# Altium schematic sheet Upstream.SchDoc: USB-C Upstream Port
size 431 x 279 mm; Author: Eric Liu; Revision: 1; SheetNumber: 2; SheetTotal: 2
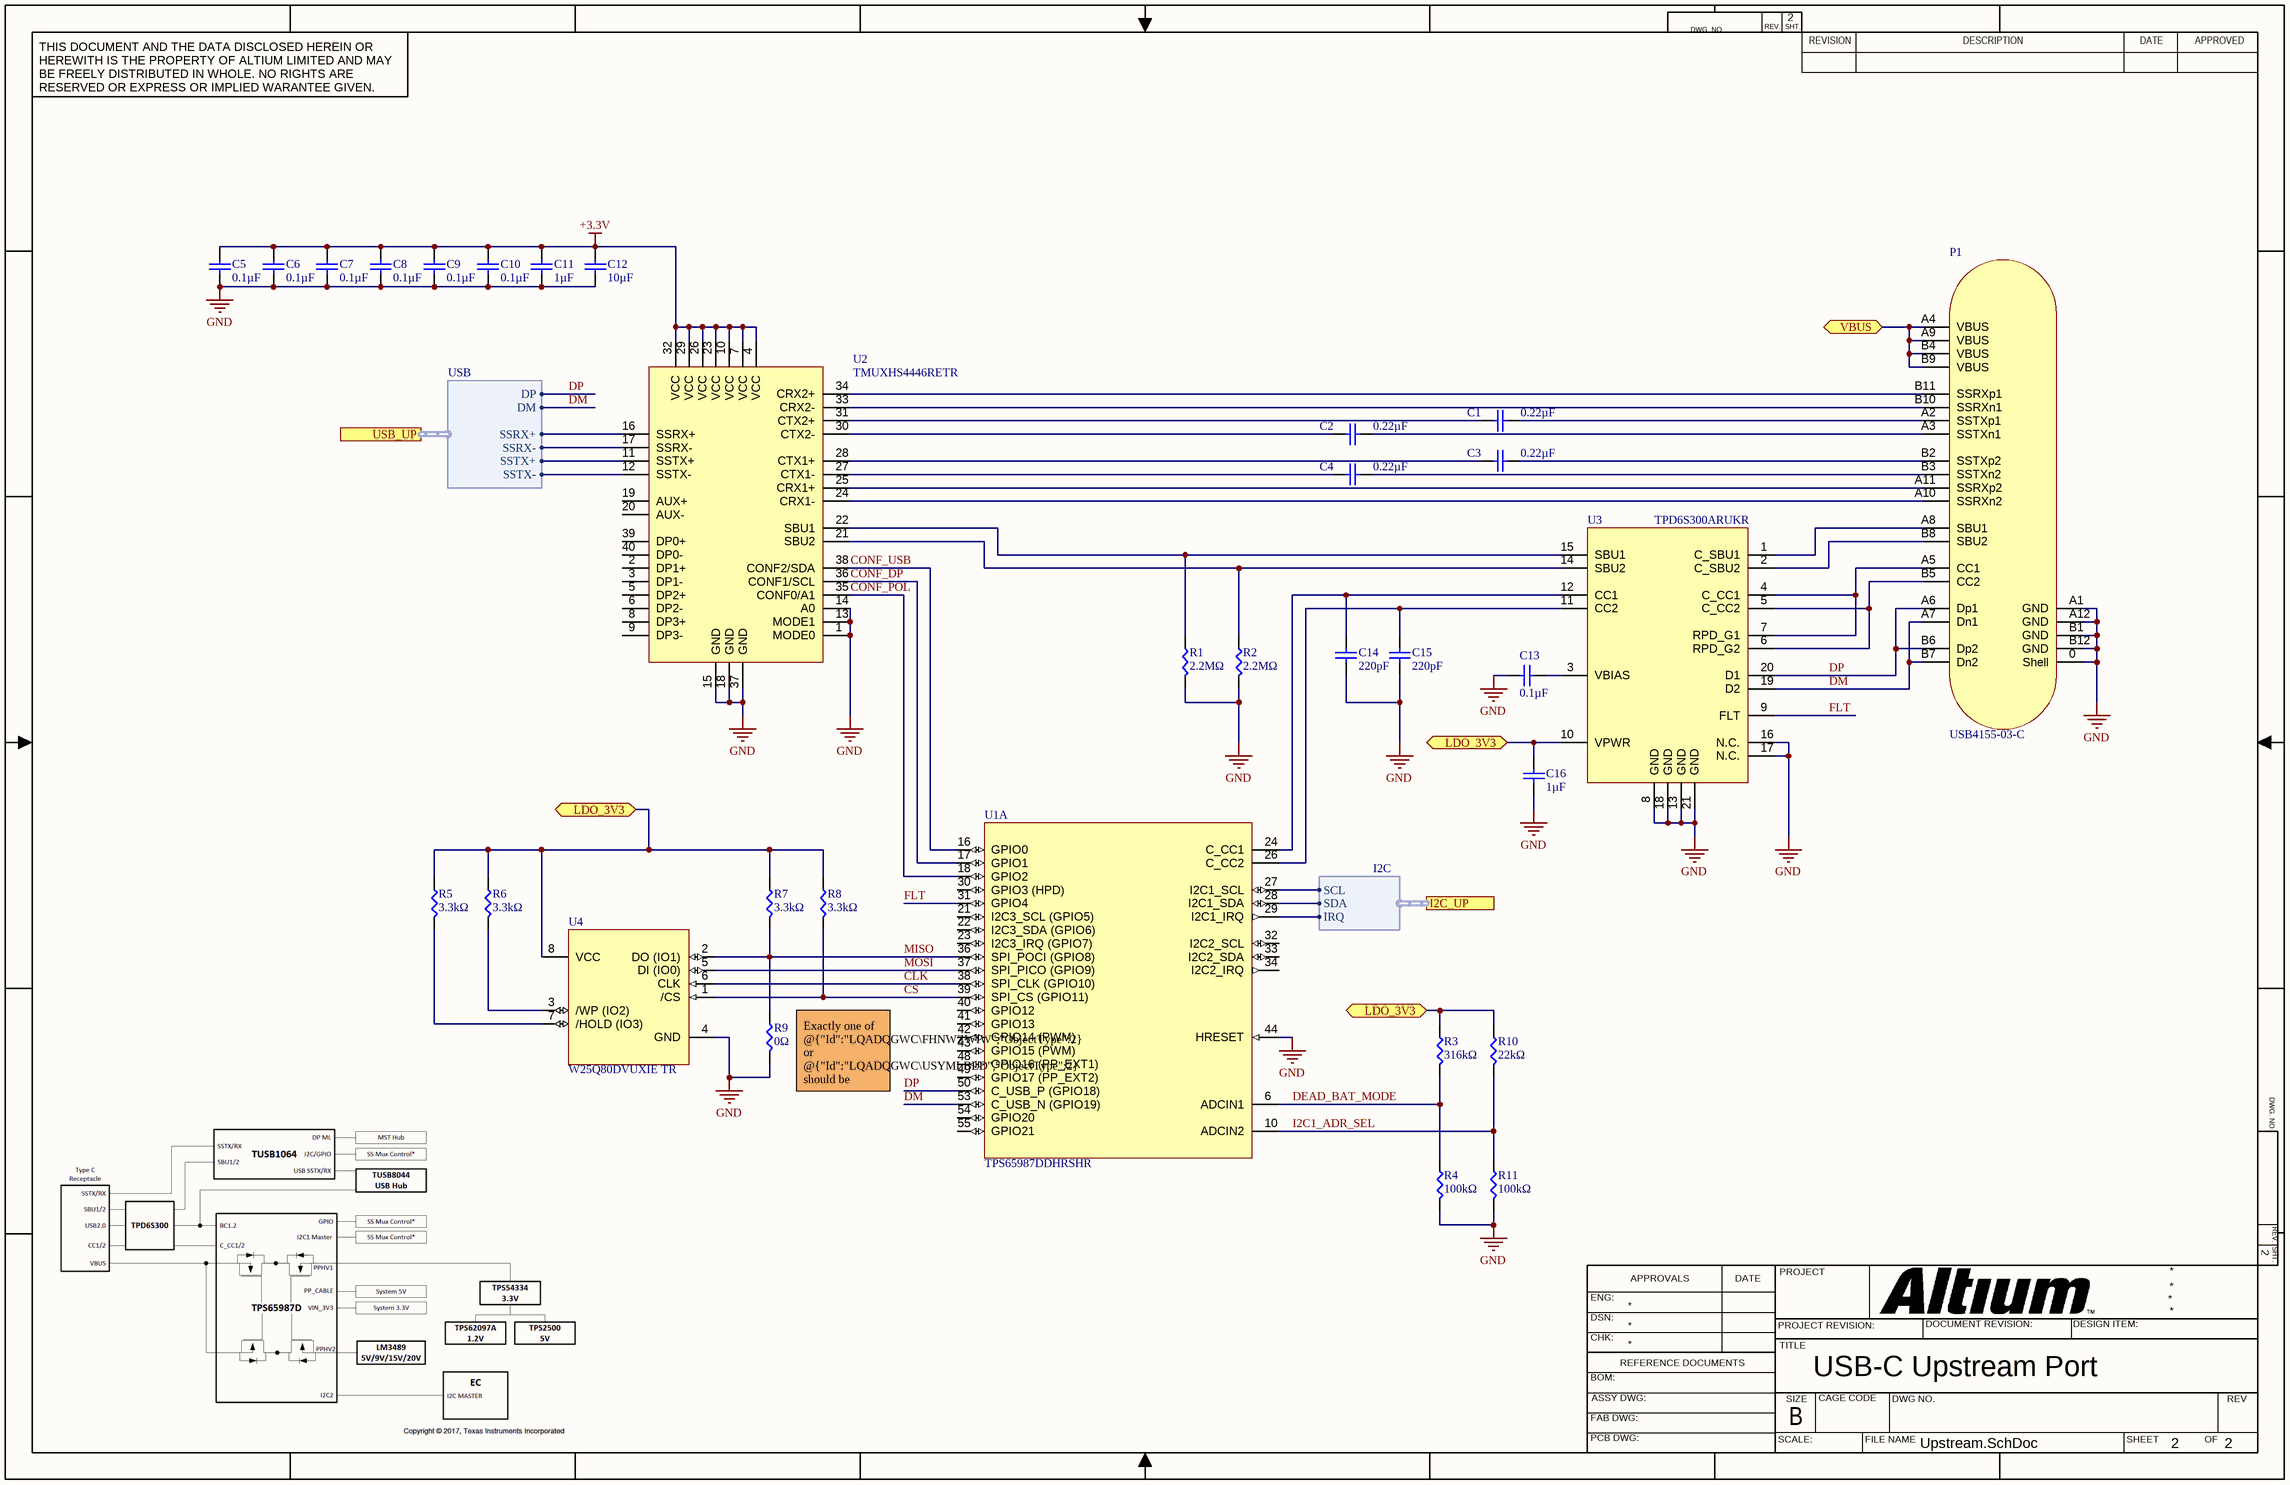
[diagram p0: Upstream.SchDoc]

## Parts
C1  value 0.22µF  [CAP0402]  (hidden comment: UMK105BJ224KV-F)
C2  value 0.22µF  [CAP0402]  (hidden comment: UMK105BJ224KV-F)
C3  value 0.22µF  [CAP0402]  (hidden comment: UMK105BJ224KV-F)
C4  value 0.22µF  [CAP0402]  (hidden comment: UMK105BJ224KV-F)
C5  value 0.1µF  [CAP0402]  (hidden comment: CC0402KRX5R9BB104)
C6  value 0.1µF  [CAP0402]  (hidden comment: CC0402KRX5R9BB104)
C7  value 0.1µF  [CAP0402]  (hidden comment: CC0402KRX5R9BB104)
C8  value 0.1µF  [CAP0402]  (hidden comment: CC0402KRX5R9BB104)
C9  value 0.1µF  [CAP0402]  (hidden comment: CC0402KRX5R9BB104)
C10  value 0.1µF  [CAP0402]  (hidden comment: CC0402KRX5R9BB104)
C11  value 1µF  [CAP0402]  (hidden comment: CL05A105KO5NNNC)
C12  value 10µF  [CAP0402]  (hidden comment: CL05A106MQ5NUNC)
C13  value 0.1µF  [CAP0402]  (hidden comment: CC0402KRX5R9BB104)
C14  value 220pF  [CAP0402]  (hidden comment: GRM1555C1H221JA01D)
C15  value 220pF  [CAP0402]  (hidden comment: GRM1555C1H221JA01D)
C16  value 1µF  [CAP0402]  (hidden comment: CL05A105KO5NNNC)
P1  USB4155-03-C  [USB4155-03-C]
R1  value 2.2MΩ  [RES0402]  (hidden comment: RC0402FR-072M2L)
R2  value 2.2MΩ  [RES0402]  (hidden comment: RC0402FR-072M2L)
R3  value 316kΩ  [RES0402]  (hidden comment: CRCW0402316KFKED)
R4  value 100kΩ  [RES0402]  (hidden comment: ERJ-2RKF1003X)
R5  value 3.3kΩ  [RES0402]  (hidden comment: ERA-2AEB332X)
R6  value 3.3kΩ  [RES0402]  (hidden comment: ERA-2AEB332X)
R7  value 3.3kΩ  [RES0402]  (hidden comment: ERA-2AEB332X)
R8  value 3.3kΩ  [RES0402]  (hidden comment: ERA-2AEB332X)
R9  value 0Ω  [RES0402]  (hidden comment: RC0402JR-070RL)
R10  value 22kΩ  [RES0402]  (hidden comment: ERJ-2RKF2202X)
R11  value 100kΩ  [RES0402]  (hidden comment: ERJ-2RKF1003X)
U1  TPS65987DDHRSHR  [56-VQFN (7x7)]  (part A of 2)
U2  TMUXHS4446RETR
U3  TPD6S300ARUKR
U4  W25Q80DVUXIE TR

## Ports
I2C_UP (harness I2C), LDO_3V3 (bidir), USB_UP (harness USB), VBUS (bidir)

## Harnesses
USB: DP, DM, SSRX+, SSRX-, SSTX+, SSTX-
I2C: SCL, SDA, IRQ

## Nets
+3.3V: C5.2 C6.2 C7.2 C8.2 C9.2 C10.2 C11.2 C12.2 U2.4(VCC) U2.7(VCC) U2.10(VCC) U2.23(VCC) U2.26(VCC) U2.29(VCC) U2.32(VCC)
GND: C5.1 C6.1 C7.1 C8.1 C9.1 C10.1 C11.1 C12.1 C13.1 C14.1 C15.1 C16.1 P1.0(Shell) P1.A1(GND) P1.A12(GND) P1.B1(GND) P1.B12(GND) R1.1 R2.1 R4.1 R9.1 R11.1 U1.44(HRESET) U2.1(MODE0) U2.13(MODE1) U2.14(A0) U2.15(GND) U2.18(GND) U2.37(GND) U3.8(GND) U3.13(GND) U3.16(N.C.) U3.17(N.C.) U3.18(GND) U3.21(GND) U4.4(GND)
CLK: U1.38(SPI_CLK_(GPIO10)) U4.6(CLK)
CONF_DP: U1.17(GPIO1) U2.36(CONF1/SCL)
CONF_POL: U1.18(GPIO2) U2.35(CONF0/A1)
CONF_USB: U1.16(GPIO0) U2.38(CONF2/SDA)
CS: R8.1 U1.39(SPI_CS_(GPIO11)) U4.1(/CS)
DEAD_BAT_MODE: R3.1 R4.2 U1.6(ADCIN1)
DM: P1.A7(Dn1) P1.B7(Dn2) U1.53(C_USB_N_(GPIO19)) U3.19(D2) ; port USB_UP.DM
DP: P1.A6(Dp1) P1.B6(Dp2) U1.50(C_USB_P_(GPIO18)) U3.20(D1) ; port USB_UP.DP
FLT: U1.31(GPIO4) U3.9(FLT)
I2C1_ADR_SEL: R10.1 R11.2 U1.10(ADCIN2)
LDO_3V3: C16.2 R3.2 R5.2 R6.2 R7.2 R8.2 R10.2 U3.10(VPWR) U4.8(VCC) ; port LDO_3V3
MISO: R7.1 R9.2 U1.36(SPI_POCI_(GPIO8)) U4.2(DO_(IO1))
MOSI: U1.37(SPI_PICO_(GPIO9)) U4.5(DI_(IO0))
VBUS: P1.A4(VBUS) P1.A9(VBUS) P1.B4(VBUS) P1.B9(VBUS) ; port VBUS
NetC1_1: C1.1 U2.31(CTX2+)
NetC1_2: C1.2 P1.A2(SSTXp1)
NetC2_1: C2.1 U2.30(CTX2-)
NetC2_2: C2.2 P1.A3(SSTXn1)
NetC3_1: C3.1 U2.28(CTX1+)
NetC3_2: C3.2 P1.B2(SSTXp2)
NetC4_1: C4.1 U2.27(CTX1-)
NetC4_2: C4.2 P1.B3(SSTXn2)
NetC13_2: C13.2 U3.3(VBIAS)
NetC14_2: C14.2 U1.24(C_CC1) U3.12(CC1)
NetC15_2: C15.2 U1.26(C_CC2) U3.11(CC2)
NetP1_A5: P1.A5(CC1) U3.4(C_CC1) U3.7(RPD_G1)
NetP1_A8: P1.A8(SBU1) U3.1(C_SBU1)
NetP1_A10: P1.A10(SSRXn2) U2.24(CRX1-)
NetP1_A11: P1.A11(SSRXp2) U2.25(CRX1+)
NetP1_B5: P1.B5(CC2) U3.5(C_CC2) U3.6(RPD_G2)
NetP1_B8: P1.B8(SBU2) U3.2(C_SBU2)
NetP1_B10: P1.B10(SSRXn1) U2.33(CRX2-)
NetP1_B11: P1.B11(SSRXp1) U2.34(CRX2+)
NetR1_2: R1.2 U2.22(SBU1) U3.15(SBU1)
NetR2_2: R2.2 U2.21(SBU2) U3.14(SBU2)
NetR5_1: R5.1 U4.7(/HOLD_(IO3))
NetR6_1: R6.1 U4.3(/WP_(IO2))
NetU1_27: U1.27(I2C1_SCL) ; port I2C_UP.SCL
NetU1_28: U1.28(I2C1_SDA) ; port I2C_UP.SDA
NetU1_29: U1.29(I2C1_IRQ) ; port I2C_UP.IRQ
NetU2_11: U2.11(SSTX+) ; port USB_UP.SSTX+
NetU2_12: U2.12(SSTX-) ; port USB_UP.SSTX-
NetU2_16: U2.16(SSRX+) ; port USB_UP.SSRX+
NetU2_17: U2.17(SSRX-) ; port USB_UP.SSRX-

Not connected (* = marked no-connect by the designer): U1 21(I2C3_SCL_(GPIO5)) 22(I2C3_SDA_(GPIO6)) 23(I2C3_IRQ_(GPIO7)) 30(GPIO3_(HPD)) 32(I2C2_SCL) 33(I2C2_SDA) 34(I2C2_IRQ) 40(GPIO12) 41(GPIO13) 42(GPIO14_(PWM)) 43(GPIO15_(PWM)) 48(GPIO16_(PP_EXT1)) 49(GPIO17_(PP_EXT2)) 54(GPIO20) 55(GPIO21); U2 2(DP1+) 3(DP1-) 5(DP2+) 6(DP2-) 8(DP3+) 9(DP3-) 19(AUX+) 20(AUX-) 39(DP0+) 40(DP0-)

## Notes on the sheet
- (near R9) Exactly one of @{"Id":"LQADQGWC\FHNWZWIW","ObjectType":2} or @{"Id":"LQADQGWC\USYMLBLD","ObjectType":2} should be attached (see Variants)
- DWG. NO.
- REV.
- SHT.
- THIS DOCUMENT AND THE DATA DISCLOSED HEREIN OR HEREWITH IS THE PROPERTY OF ALTIUM LIMITED AND MAY BE FREELY DISTRIBUTED IN WHOLE. NO RIGHTS ARE RESERVED OR EXPRESS OR IMPLIED WARANTEE GIVEN.
- REVISION
- DESCRIPTION
- DATE
- APPROVED
- ENG:
- APPROVALS
- PROJECT
- DSN:
- CHK:
- REFERENCE DOCUMENTS
- PROJECT REVISION:
- TITLE
- DOCUMENT REVISION:
- DESIGN ITEM:
- BOM:
- FAB DWG:
- PCB DWG:
- ASSY DWG:
- SCALE:
- SIZE
- B
- CAGE CODE
- FILE NAME
- DWG NO.
- SHEET
- OF
- REV

## Library data of the parts
C1-C4 = UMK105BJ224KV-F: 0.22 µF ±10% 50V Ceramic Capacitor X5R 0402 (1005 Metric); Temperature Coefficient: X5R; Package: 0402 (1005 Metric); Voltage: 50V
C5-C10 C13 = CC0402KRX5R9BB104: 0.1 µF ±10% 50V Ceramic Capacitor X5R 0402 (1005 Metric); Temperature Coefficient: X5R; Package: 0402 (1005 Metric); Voltage: 50V
C11 C16 = CL05A105KO5NNNC: 1 µF ±10% 16V Ceramic Capacitor X5R 0402 (1005 Metric); Temperature Coefficient: X5R; Package: 0402 (1005 Metric); Voltage: 16V
C12 = CL05A106MQ5NUNC: 10 µF ±20% 6.3V Ceramic Capacitor X5R 0402 (1005 Metric); Temperature Coefficient: C0G, NP0; Package: 0402 (1005 Metric); Voltage: 6.3V
C14 C15 = GRM1555C1H221JA01D: 220 pF ±5% 50V Ceramic Capacitor C0G, NP0 0402 (1005 Metric); Temperature Coefficient: C0G, NP0; Package: 0402 (1005 Metric); Voltage: 50V
P1 = USB4155-03-C: USB-C (USB TYPE-C) USB 3.2 Gen 2 (USB 3.1 Gen 2, Superspeed + (USB 3.1)) Plug Connector 24 Position Board Edge, Surface Mount; Through Hole, Right Angle; Manufacturer: GCT; Manufacturer Product Number: USB4056-03-A; Voltage: 48VDC; Supplier: DigiKey; Supplier Part Number: 2073-USB4056-03-ACT-ND; Datasheet: https://gct.co/connector/usb4056; Standards: USB 3.2 Gen 2; Operating Temperature: -25°C ~ 85°C
R1 R2 = RC0402FR-072M2L: 2.2 MOhms ±1% 0.063W, 1/16W Chip Resistor 0402 (1005 Metric) Moisture Resistant Thick Film; Manufacturer 1: YAGEO; Manufacturer Part Number 1: RC0402FR-072M2L; Supplier Part Number 1: 13-RC0402FR-072M2LCT-ND; Supplier 1: Digi-Key; Power Rating: 1/16W
R3 = CRCW0402316KFKED: 316 kOhms ±1% 0.1W, 1/10W Chip Resistor 0402 (1005 Metric) Automotive AEC-Q200 Thick Film; Manufacturer 1: Vishay Dale; Manufacturer Part Number 1: CRCW0402316KFKED; Supplier Part Number 1: 541-316KLCT-ND; Supplier 1: Digi-Key; Power Rating: 1/10W
R4 R11 = ERJ-2RKF1003X: 100 kOhms ±1% 0.1W, 1/10W Chip Resistor 0402 (1005 Metric) Automotive AEC-Q200 Thick Film; Manufacturer 1: Panasonic Electronic Components; Manufacturer Part Number 1: ERJ-2RKF1003X; Supplier Part Number 1: P100KLCT-ND; Supplier 1: Digi-Key; Power Rating: 1/10W
R5-R8 = ERA-2AEB332X: 3.3 kOhms ±0.1% 0.063W, 1/16W Chip Resistor 0402 (1005 Metric) Automotive AEC-Q200 Thin Film; Manufacturer 1: Panasonic Electronic Components; Manufacturer Part Number 1: ERA-2AEB332X; Supplier Part Number 1: P3.3KDCCT-ND; Supplier 1: Digi-Key; Power Rating: 1/16W
R9 = RC0402JR-070RL: 0 Ohms Jumper Chip Resistor 0402 (1005 Metric) Moisture Resistant Thick Film; Manufacturer 1: YAGEO; Power Rating: 1/16W; Manufacturer Part Number 1: RC0402JR-070RL; Supplier Part Number 1: 311-0.0JRCT-ND; Supplier 1: Digi-Key
R10 = ERJ-2RKF2202X: 22 kOhms ±1% 0.1W, 1/10W Chip Resistor 0402 (1005 Metric) Automotive AEC-Q200 Thick Film; Manufacturer 1: Panasonic Electronic Components; Manufacturer Part Number 1: ERJ-2RKF2202X; Supplier Part Number 1: P22.0KLCT-ND; Supplier 1: Digi-Key; Power Rating: 1/10W
U1 = TPS65987DDHRSHR: USB, Type-C Controller PMIC 56-VQFN (7x7); Manufacturer: Texas Instruments; Standards: USB4 PD 3.0; Manufacturer Product Number: TPS65987DDHRSHR; Supplier: DigiKey; Supplier Part Number: 296-52067-1-ND; Datasheet: https://www.ti.com/lit/ds/symlink/tps65987d.pdf?HQS=dis-dk-null-digikeymode-dsf-pf-null-wwe&ts=1769374030059; Operating Temperature: -10°C ~ 75°C
U2 = TMUXHS4446RETR: 4 Circuit IC Switch 4:4 7Ohm (Typ) 40-WQFN (6x3); Manufacturer: Texas Instruments; Standards: USB 3.2 Gen 2, DP 2.1; Manufacturer Product Number: TMUXHS4446RETR; Supplier: DigiKey; Supplier Part Number: 296-TMUXHS4446RETRCT-ND; Datasheet: https://www.ti.com/lit/ds/symlink/tmuxhs4446.pdf?ts=1710887339890&ref_url=https%253A%252F%252Fwww.ti.com%252Fproduct%252FTMUXHS4446%253Fjktype%253Dhomepageproduct; Operating Temperature: -40°C ~ 85°C
U3 = TPD6S300ARUKR: Overvoltage/Surge Protection IC 8V Internal Switch 20-WQFN (3x3); Manufacturer: Texas Instruments; Manufacturer Product Number: TPD6S300ARUKR; Supplier: DigiKey; Supplier Part Number: 296-51856-1-ND; Datasheet: https://www.ti.com/lit/ds/symlink/tpd6s300a.pdf?ts=1769365287609; Operating Temperature: -40°C ~ 85°C
U4 = W25Q80DVUXIE TR: FLASH - NOR Memory IC 8Mbit SPI - Quad I/O 104 MHz 8-USON (2x3); Manufacturer: Winbond Electronics; Manufacturer Product Number: W25Q80DVUXIE TR; Supplier: DigiKey; Supplier Part Number: 256-W25Q80DVUXIETRCT-ND; Datasheet: https://www.winbond.com/resource-files/w25q80dv%20dl_revh_10022015.pdf; Standards: SPI - Quad I/O; Operating Temperature: -40°C ~ 85°C